# EAGLE schematic power_rev1 (EAGLE 9.6.2)
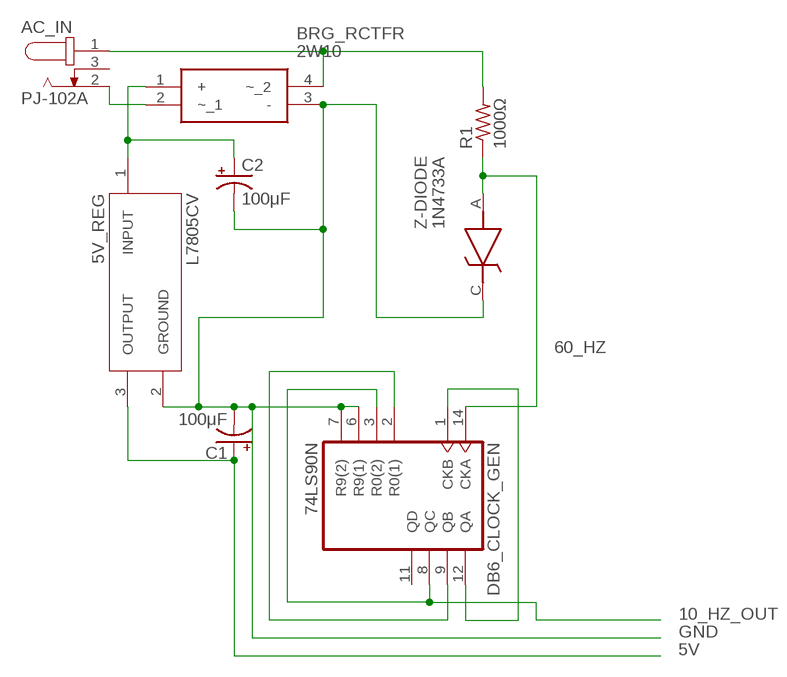
[diagram p0: schematic, sheet 1]

## Parts
5V_REG  L7805CV  [TO255P1040X460X1968-3]
AC_IN  PJ-102A  [CUI_PJ-102A]
BRG_RCTFR  2W10  [2W10]
C1  100μF  CPOL-USE2.5-6  [E2,5-6]
C2  100μF  CPOL-USE2.5-6  [E2,5-6]
DB6_CLOCK_GEN  74LS90N  [DIL14]
R1  1000Ω  R-US_0207/7  [0207/7]
Z-DIODE  1N4733A  [DIOAD1125W80L520D270]

## Nets
5V: 5V_REG.3(OUTPUT) C1.+
10_HZ_OUT: DB6_CLOCK_GEN.3(R0(2)) DB6_CLOCK_GEN.8(QC)
60_HZ: DB6_CLOCK_GEN.14(CKA) R1.1 Z-DIODE.A
GND: 5V_REG.2(GROUND) BRG_RCTFR.3(-) C1.- C2.- DB6_CLOCK_GEN.6(R9(1)) DB6_CLOCK_GEN.7(R9(2)) Z-DIODE.C(K)
N$1: AC_IN.2 BRG_RCTFR.2(~_1)
N$3: AC_IN.1 BRG_RCTFR.4(~_2) R1.2
N$4: DB6_CLOCK_GEN.1(CKB) DB6_CLOCK_GEN.12(QA)
N$5: 5V_REG.1(INPUT) BRG_RCTFR.1(+) C2.+
N$8: DB6_CLOCK_GEN.2(R0(1)) DB6_CLOCK_GEN.9(QB)
Unconnected: AC_IN.3 DB6_CLOCK_GEN.11(QD)

## Power pins joined to a net without a drawn wire
GND: DB6_CLOCK_GEN.10(GND)
VCC: DB6_CLOCK_GEN.5(VCC)

## Library data of the parts
5V_REG = L7805CV:L7805CV: Standard Regulator Pos 5V 1.5A 3-Pin(3+Tab) TO-220 Standard Regulator Pos 5V 1.5A 3-Pin(3+Tab) TO-220; AVAILABILITY: Unavailable; DESCRIPTION: Linear Voltage Regulator IC 1 Output 1.5A TO-220; MF: STMicroelectronics; MP: L7805CV; PACKAGE: TO-220 STMicroelectronics; PRICE: None
AC_IN = PJ-102A:PJ-102A: 2.0 mm Center Pin, 2.5 A, Right Angle, Through Hole, Tapered Pins, Dc Power Jack Connector; MANUFACTURER: CUI INC; PART_REV: 1.03; STANDARD: Manufacturer recommendations
BRG_RCTFR = 2W10:2W10: Silicon Bridge Rectifier, single phase, 2.0A Source: Datasheet <https://goodarksemi.com/docs/datasheets/general_purpose_bridge_rectifiers/2Wxx.pdf>; ARROW_PART_NUMBER: 2W10; ARROW_PRICE-STOCK: https://www.arrow.com/en/products/2w10/good-ark-semiconductor; DESCRIPTION: Silicon Bridge Rectifier, single phase, 2.0A; HEIGHT: mm; MANUFACTURER_NAME: Good-Ark; MANUFACTURER_PART_NUMBER: 2W10
C1 C2 = rcl:CPOL-US: POLARIZED CAPACITOR, American symbol; SPICEPREFIX: C
DB6_CLOCK_GEN = 74xx-us:74*90: Decade, divide by twelve and binary COUNTER
R1 = rcl:R-US_: RESISTOR, American symbol; SPICEPREFIX: R
Z-DIODE = 1n4733a:1N4733A